# Altium schematic sheet NRF24L01_PA.SchDoc
size A4
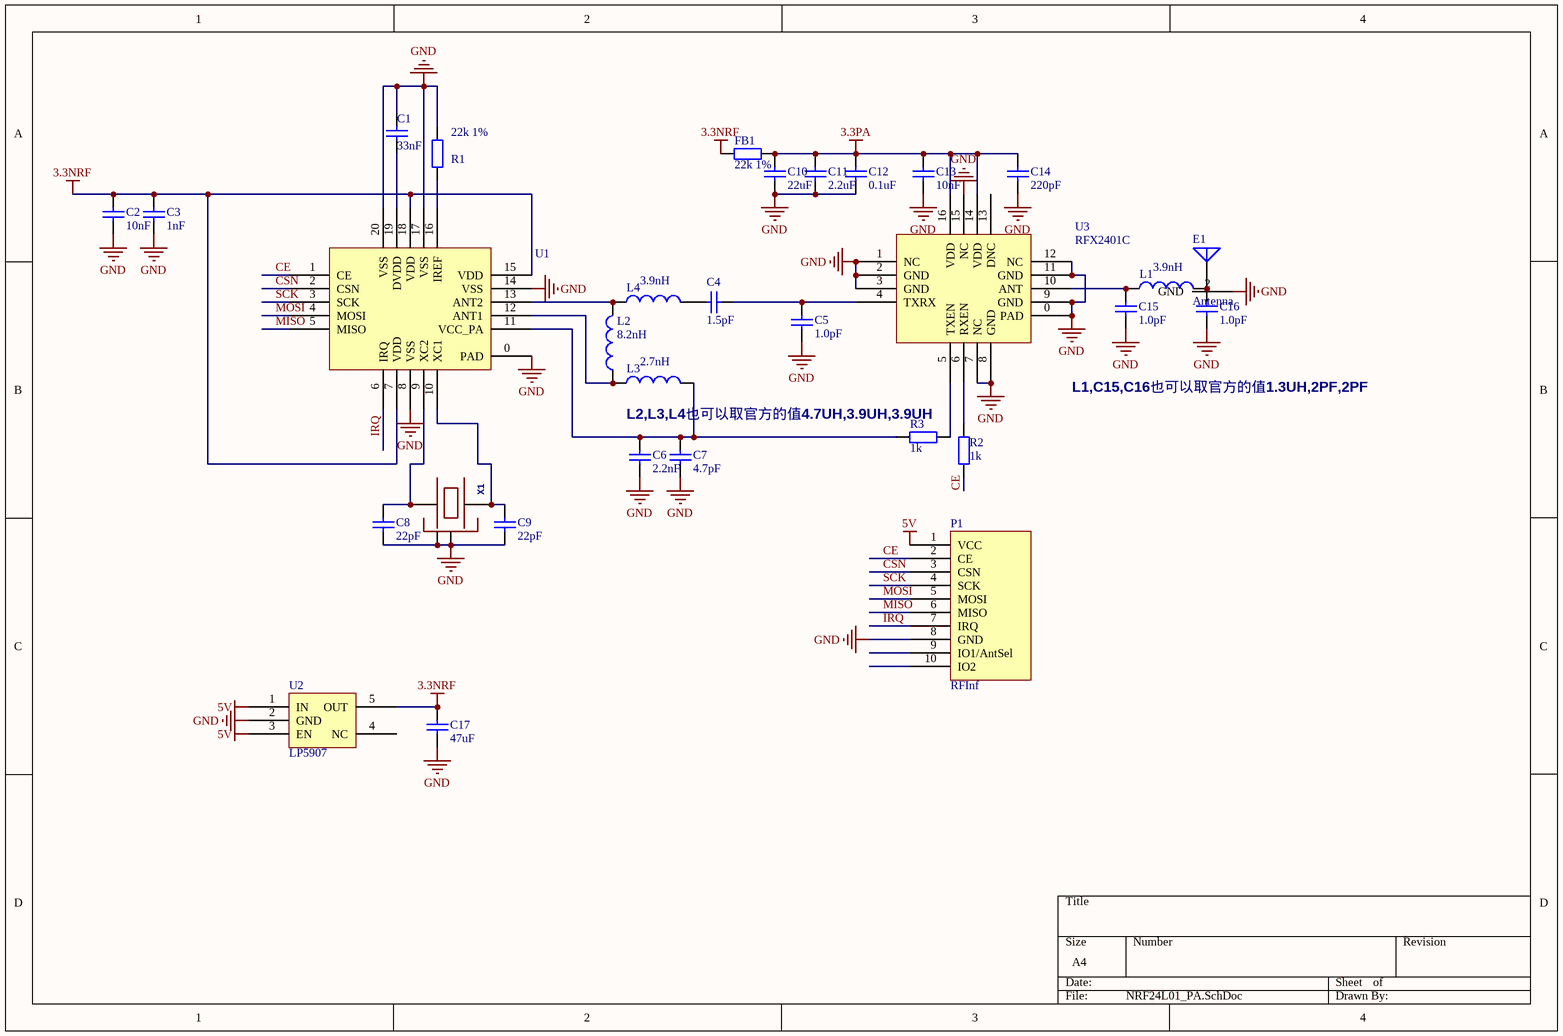
[diagram p0: NRF24L01_PA.SchDoc]

## Parts
C1  value 33nF  [0402]  (hidden comment: Cap)
C2  value 10nF  [0402]  (hidden comment: Cap)
C3  value 1nF  [0402]  (hidden comment: Cap)
C4  value 1.5pF  [0402]  (hidden comment: Cap)
C5  value 1.0pF  [0402]  (hidden comment: Cap)
C6  value 2.2nF  [0402]  (hidden comment: Cap)
C7  value 4.7pF  [0402]  (hidden comment: Cap)
C8  value 22pF  [0402]  (hidden comment: Cap)
C9  value 22pF  [0402]  (hidden comment: Cap)
C10  value 22uF  [0805]  (hidden comment: Cap)
C11  value 2.2uF  [0402]  (hidden comment: Cap)
C12  value 0.1uF  [0402]  (hidden comment: Cap)
C13  value 10nF  [0402]  (hidden comment: Cap)
C14  value 220pF  [0402]  (hidden comment: Cap)
C15  value 1.0pF  [0402]  (hidden comment: Cap)
C16  value 1.0pF  [0402]  (hidden comment: Cap)
C17  value 47uF  [0805]  (hidden comment: Cap)
E1  Antenna  [IPEX]
FB1  value 22k 1%  [0603]  (hidden comment: Res2)
L1  value 3.9nH  [0402]  (hidden comment: Inductor)
L2  value 8.2nH  [0402]  (hidden comment: Inductor)
L3  value 2.7nH  [0402]  (hidden comment: Inductor)
L4  value 3.9nH  [0402]  (hidden comment: Inductor)
P1  RFInf  [RFInf]
R1  value 22k 1%  [0402]  (hidden comment: Res2)
R2  value 1k  [0402]  (hidden comment: Res2)
R3  value 1k  [0402]  (hidden comment: Res2)
U1  NRF24L01  [NRF24L01]  (value not drawn)
U2  LP5907  [SOT23-5]
U3  RFX2401C  [RFX2401C]
X1  16Mhz  [OSCILLATOR-3.2X2.5]  (value not drawn)

## Nets
3.3NRF: C2.1 C3.1 C17.1 FB1.1 U1.7(VDD) U1.15(VDD) U1.18(VDD) U2.5(OUT)
3.3PA: C10.1 C11.1 C12.1 C13.1 C14.1 FB1.2 U3.14(VDD) U3.16(VDD)
5V: P1.1(VCC) U2.1(IN) U2.3(EN)
GND: C1.1 C2.2 C3.2 C5.2 C6.2 C7.2 C8.2 C9.2 C10.2 C11.2 C12.2 C13.2 C14.2 C15.2 C16.2 C17.2 E1.2(GND) P1.8(GND) R1.1 U1.0(PAD) U1.8(VSS) U1.14(VSS) U1.17(VSS) U1.20(VSS) U2.2(GND) U3.0(PAD) U3.1(NC) U3.2(GND) U3.3(GND) U3.7(NC) U3.8(GND) U3.9(GND) U3.11(GND) U3.12(NC) U3.15(NC) X1.2(NC_2) X1.4(NC_4)
CE: P1.2(CE) R2.1 U1.1(CE)
CSN: P1.3(CSN) U1.2(CSN)
IRQ: P1.7(IRQ) U1.6(IRQ)
MISO: P1.6(MISO) U1.5(MISO)
MOSI: P1.5(MOSI) U1.4(MOSI)
SCK: P1.4(SCK) U1.3(SCK)
NetC1_2: C1.2 U1.19(DVDD)
NetC4_1: C4.1 L4.2
NetC4_2: C4.2 C5.1 U3.4(TXRX)
NetC6_1: C6.1 C7.1 L3.2 R3.1 U1.11(VCC_PA)
NetC8_1: C8.1 U1.9(XC2) X1.1
NetC9_1: C9.1 U1.10(XC1) X1.3
NetC15_1: C15.1 L1.1 U3.10(ANT)
NetC16_1: C16.1 E1.1(ANT) L1.2
NetL2_1: L2.1 L3.1 U1.12(ANT1)
NetL2_2: L2.2 L4.1 U1.13(ANT2)
NetR1_2: R1.2 U1.16(IREF)
NetR2_2: R2.2 U3.6(RXEN)
NetR3_2: R3.2 U3.5(TXEN)

Not connected (* = marked no-connect by the designer): P1 9(IO1/AntSel) 10(IO2); U2 4(NC); U3 13(DNC)

## Notes on the sheet
- L2,L3,L4也可以取官方的值4.7UH,3.9UH,3.9UH
- L1,C15,C16也可以取官方的值1.3UH,2PF,2PF

## Library data of the parts
C1-C17 = Cap: Capacitor; Published: 8-Jun-2000; LatestRevisionDate: 17-Jul-2002; LatestRevisionNote: Re-released for DXP Platform.; PackageReference: RAD-0.3; Publisher: Altium Limited; PackageDescription: Radial Cap, Thru-Hole; 2 Leads; 0.3 in Pin Spacing
E1 = Antenna: Generic Antenna; Published: 24-Mar-1999; LatestRevisionDate: 17-Jul-2002; LatestRevisionNote: Re-released for DXP Platform.; PackageReference: PIN1; Publisher: Altium Limited
FB1 R1-R3 = Res2: Resistor; Published: 8-Jun-2000; LatestRevisionDate: 17-Jul-2002; LatestRevisionNote: Re-released for DXP Platform.; PackageReference: AXIAL-0.4; Publisher: Altium Limited; PackageDescription: Axial Device, Thru-Hole; 2 Leads; 0.4 in Pin Spacing
L1-L4 = Inductor: Code_IEC: 1005; Published: 8-Jun-2000; LatestRevisionDate: 29-May-2009; LatestRevisionNote: IPC-7351 Footprint Added.; PackageReference: 0402-A; Publisher: Altium Limited; PackageDescription: Chip Inductor; Code_JEITA: 0402
X1 = OSCILLATOR-3.2X2.5: Crystal Oscillator in 3.2x2.5 SMD